# EAGLE design DriveBayLCD (EAGLE 6.5.0)
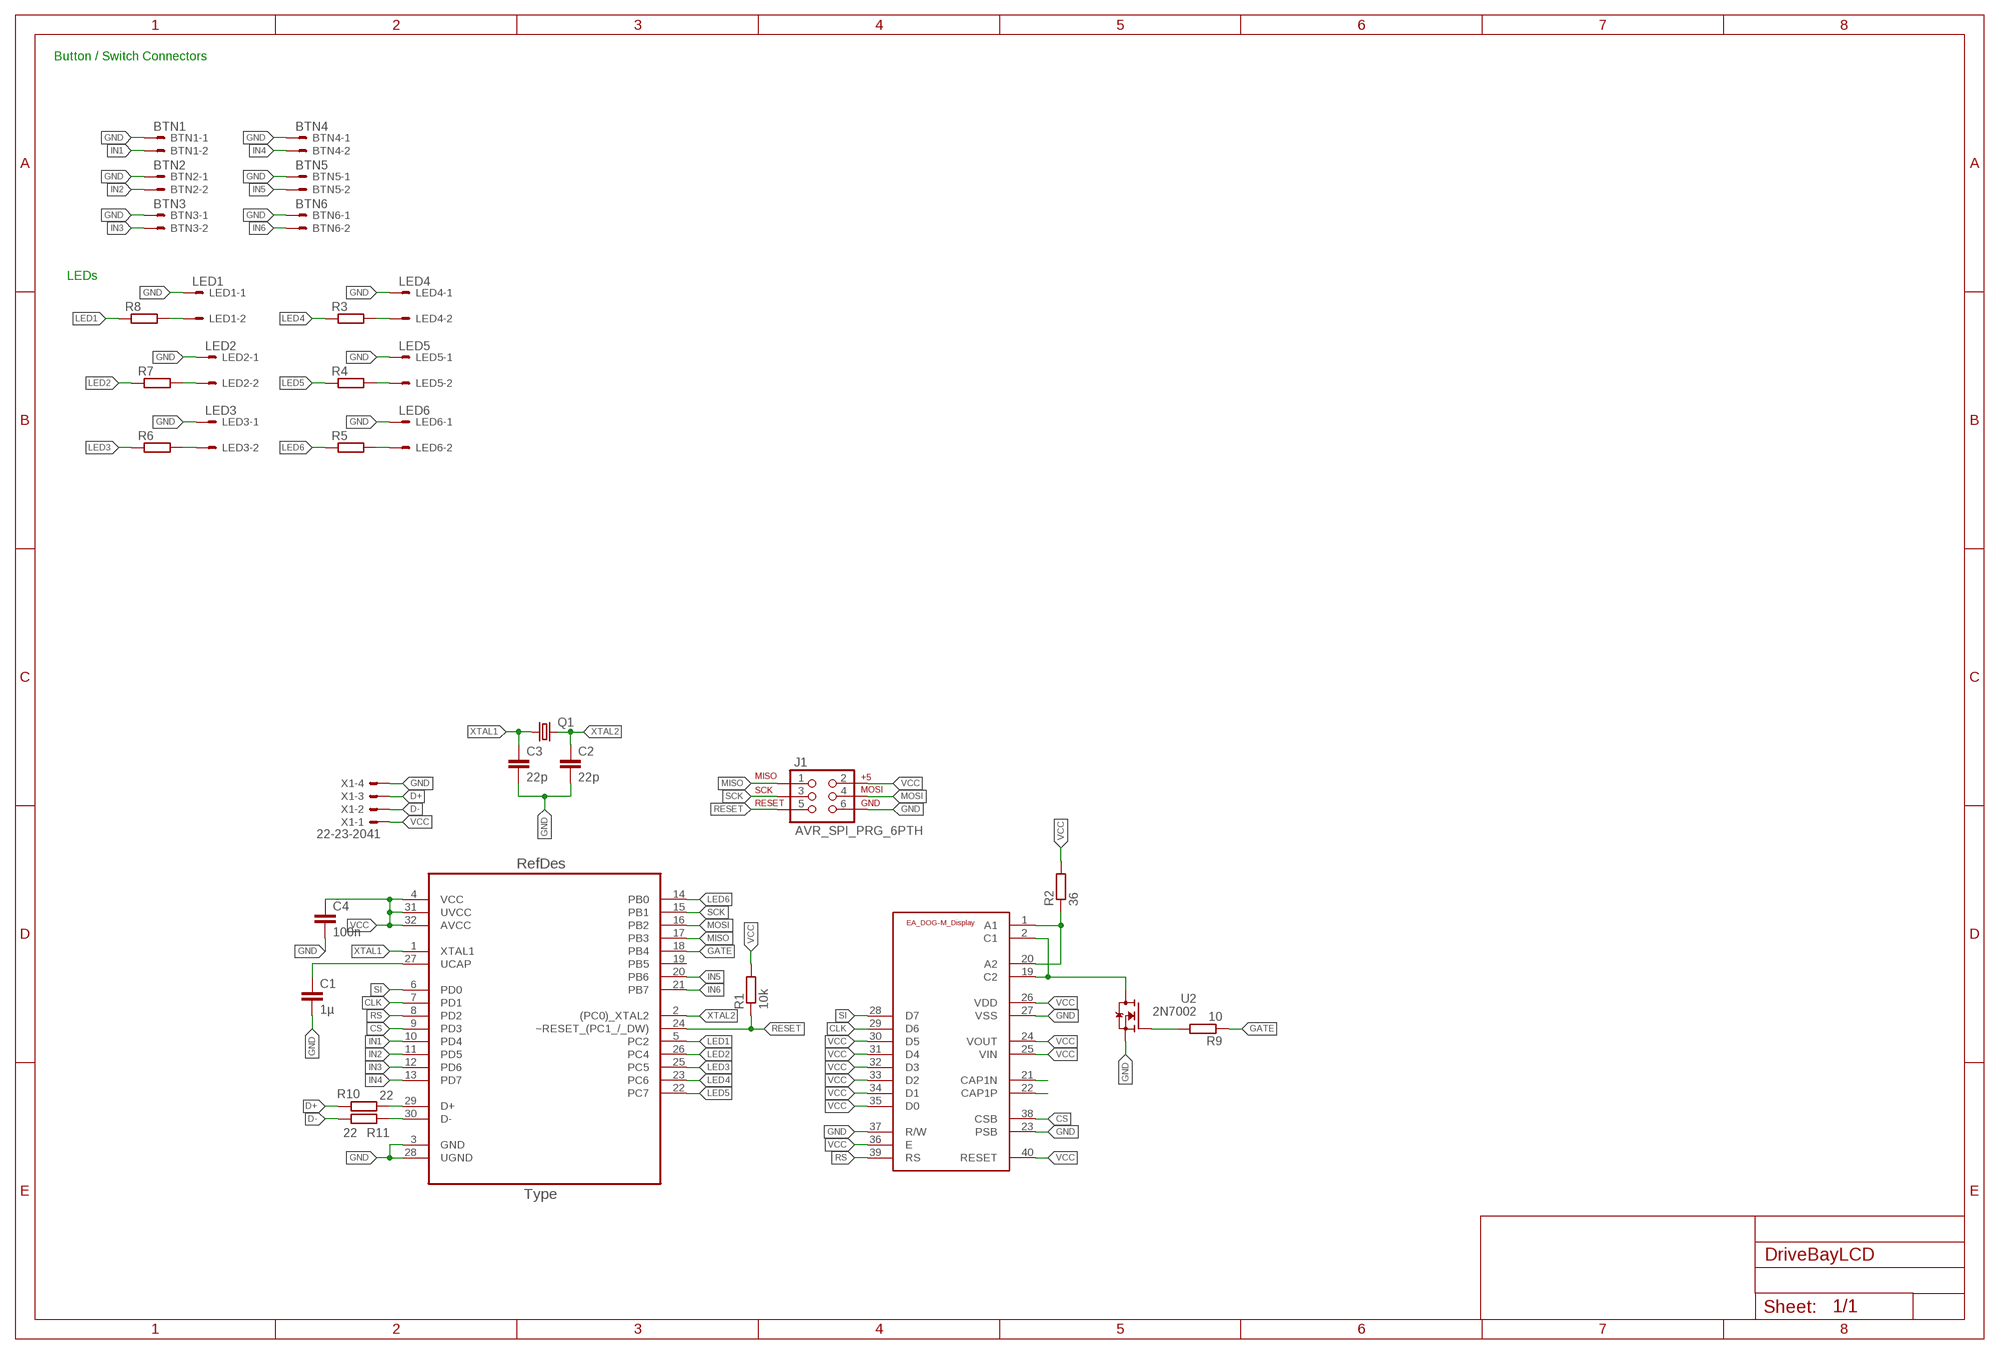
[diagram p0: schematic, sheet 1]

## Parts
BTN1  BTN1  22-23-2021  [22-23-2021]
BTN2  BTN2  22-23-2021  [22-23-2021]
BTN3  BTN3  22-23-2021  [22-23-2021]
BTN4  BTN4  22-23-2021  [22-23-2021]
BTN5  BTN5  22-23-2021  [22-23-2021]
BTN6  BTN6  22-23-2021  [22-23-2021]
C1  1µ  C-EUC0805  [C0805]
C2  22p  C-EUC0805  [C0805]
C3  22p  C-EUC0805  [C0805]
C4  100n  C-EUC0805  [C0805]
J1  AVR_SPI_PRG_6PTH  [2X3]
LED1  LED1  22-23-2021  [22-23-2021]
LED2  LED2  22-23-2021  [22-23-2021]
LED3  LED3  22-23-2021  [22-23-2021]
LED4  LED4  22-23-2021  [22-23-2021]
LED5  LED5  22-23-2021  [22-23-2021]
LED6  LED6  22-23-2021  [22-23-2021]
Q1  CRYSTALHC49S  [HC49/S]
R1  10k  R-EU_R0805  [R0805]
R2  36  R-EU_R0805  [R0805]
R3  R-EU_R0805  [R0805]
R4  R-EU_R0805  [R0805]
R5  R-EU_R0805  [R0805]
R6  R-EU_R0805  [R0805]
R7  R-EU_R0805  [R0805]
R8  R-EU_R0805  [R0805]
R9  10  R-EU_R0805  [R0805]
R10  22  R-EU_R0805  [R0805]
R11  22  R-EU_R0805  [R0805]
U1  ATMEGA32U2-AU  [QFP80P900X900X120-32N]
U2  2N7002  [SOT23-3-ROTATED]
U$1  EA_DOG-M_DISPLAY  [E_DOG-M_DISPLAY]
X1  22-23-2041  [22-23-2041]

## Nets
CLK: U1.7(PD1) U$1.29(D6)
CS: U1.9(PD3) U$1.38(CSB)
D+: R10.2 X1.3
D-: R11.2 X1.2
GATE: R9.1 U1.18(PB4)
GND: BTN1.1 BTN2.1 BTN3.1 BTN4.1 BTN5.1 BTN6.1 C1.2 C2.2 C3.2 C4.2 J1.6 LED1.1 LED2.1 LED3.1 LED4.1 LED5.1 LED6.1 U1.3(GND) U1.28(UGND) U2.2(S) U$1.23(PSB) U$1.27(VSS) U$1.37(R/W) X1.4
IN1: BTN1.2 U1.10(PD4)
IN2: BTN2.2 U1.11(PD5)
IN3: BTN3.2 U1.12(PD6)
IN4: BTN4.2 U1.13(PD7)
IN5: BTN5.2 U1.20(PB6)
IN6: BTN6.2 U1.21(PB7)
LED1: R8.1 U1.5(PC2)
LED2: R7.1 U1.26(PC4)
LED3: R6.1 U1.25(PC5)
LED4: R3.1 U1.23(PC6)
LED5: R4.1 U1.22(PC7)
LED6: R5.1 U1.14(PB0)
MISO: J1.1 U1.17(PB3)
MOSI: J1.4 U1.16(PB2)
N$1: LED1.2 R8.2
N$2: LED2.2 R7.2
N$4: LED3.2 R6.2
N$5: LED6.2 R5.2
N$6: C1.1 U1.27(UCAP)
N$7: LED5.2 R4.2
N$8: LED4.2 R3.2
N$25: R2.1 U$1.1(A1) U$1.20(A2)
N$33: U$1.21(CAP1N)
N$34: U$1.22(CAP1P)
N$123: R9.2 U2.1(G)
N$125: R10.1 U1.29(D+)
N$126: R11.1 U1.30(D-)
RESET: J1.5 R1.1 U1.24(~RESET_(PC1_/_DW))
RS: U1.8(PD2) U$1.39(RS)
SCK: J1.3 U1.15(PB1)
SI: U1.6(PD0) U$1.28(D7)
V$1: U2.3(D) U$1.2(C1) U$1.19(C2)
VCC: C4.1 J1.2 R1.2 R2.2 U1.4(VCC) U1.31(UVCC) U1.32(AVCC) U$1.24(VOUT) U$1.25(VIN) U$1.26(VDD) U$1.30(D5) U$1.31(D4) U$1.32(D3) U$1.33(D2) U$1.34(D1) U$1.35(D0) U$1.36(E) U$1.40(RESET) X1.1
XTAL1: C3.1 Q1.1 U1.1(XTAL1)
XTAL2: C2.1 Q1.2 U1.2((PC0)_XTAL2)
Unconnected: U1.19(PB5)

## Notes on the sheet
- Button / Switch Connectors
- LEDs

## Library data of the parts
BTN1-BTN6 LED1-LED6 = con-molex:22-23-2021: .100" (2.54mm) Center Header - 2 Pin; MF: MOLEX; MPN: 22-23-2021; OC_FARNELL: 1462926; OC_NEWARK: 25C3832
C1-C4 = rcl:C-EU: CAPACITOR, European symbol
J1 = SparkFun:AVR_SPI_PRG_6: AVR ISP 6 Pin This is the reduced ISP connector for AVR programming. Common on Arduino. This footprint will take up less PCB space and can be used with a 10-pin to 6-pin adapter such as SKU: BOB-08508
Q1 = crystal:CRYSTAL: CRYSTAL; OC_FARNELL: 1667008; OC_NEWARK: unknown
R1-R11 = resistor:R-EU_: RESISTOR, European symbol
U1 = Atmel-ATMEGA32U2-AU:ATMEGA32U2-AU; DESCRIPTION: 8-bit Microcontroller with ISP Flash and USB Controller; MPN: ATMEGA32U2-AU; OC_FARNELL: 1748524; OC_NEWARK: 26R5632; PACKAGE: TQFP-32; SUPPLIER: Atmel
U2 = SteveMarple:2N7002: N-CHANNEL ENHANCEMENT MODE FIELD EFFECT TRANSISTOR; MPN: 2N7002-7-F; OC_FARNELL: 1713823; OC_NEWARK: 25R5679; PACKAGE: SOT-23-3; SUPPLIER: DIODES INC.
U$1 = display_ea_dog-m:EA_DOG-M_DISPLAY
X1 = con-molex:22-23-2041: .100" (2.54mm) Center Header - 4 Pin; MF: MOLEX; MPN: 22-23-2041; OC_FARNELL: 1462920; OC_NEWARK: 38C0355

## Board
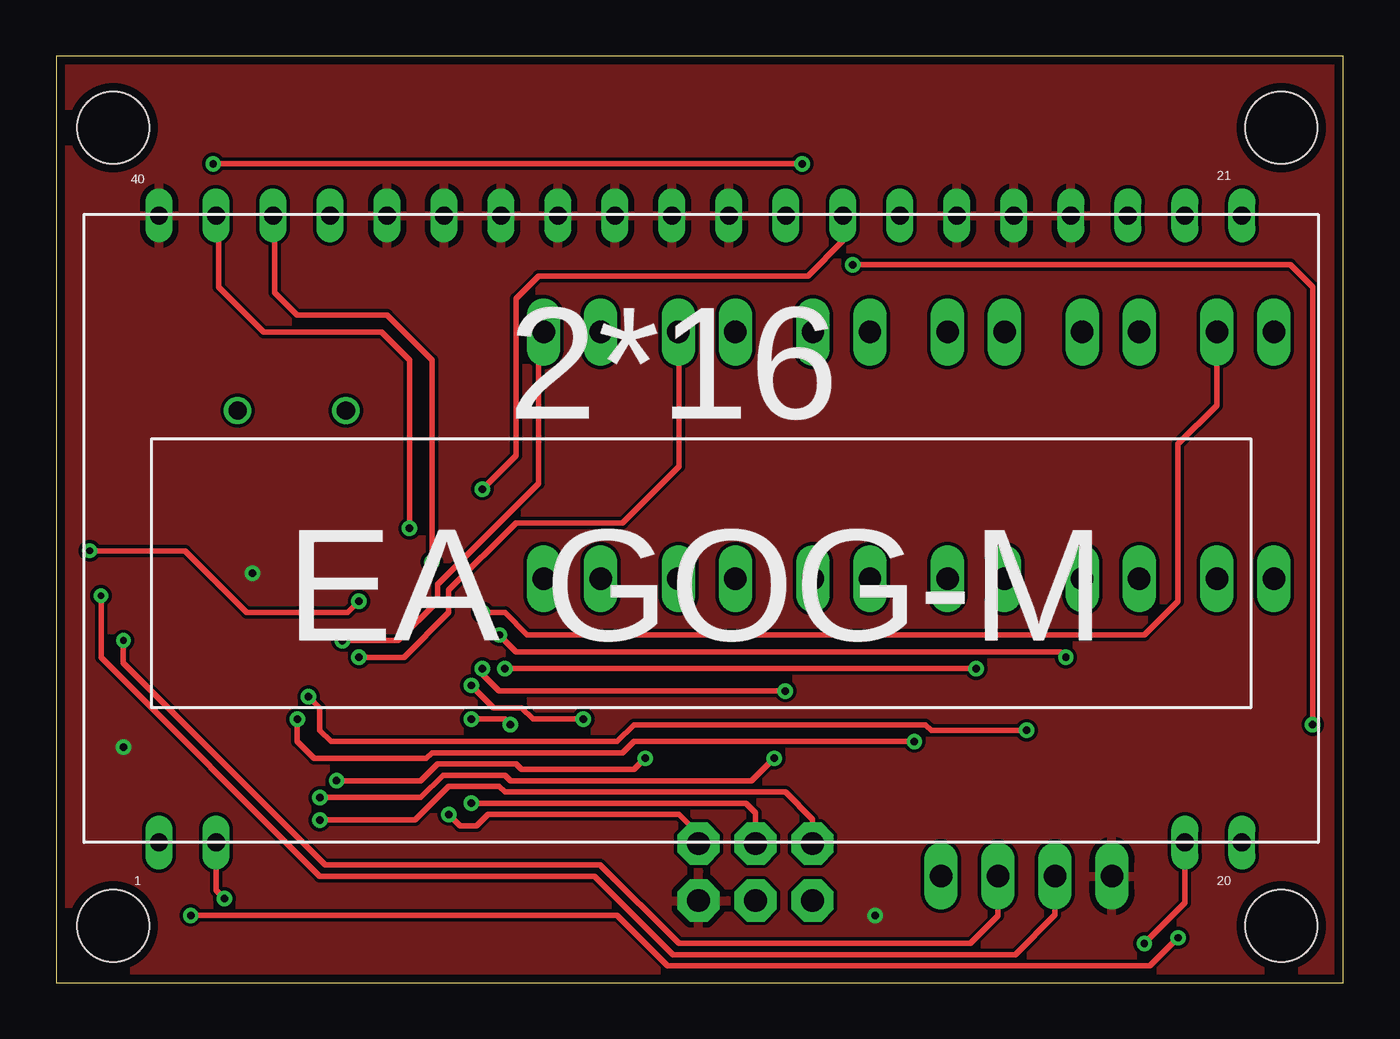
[diagram p1: board, top side]
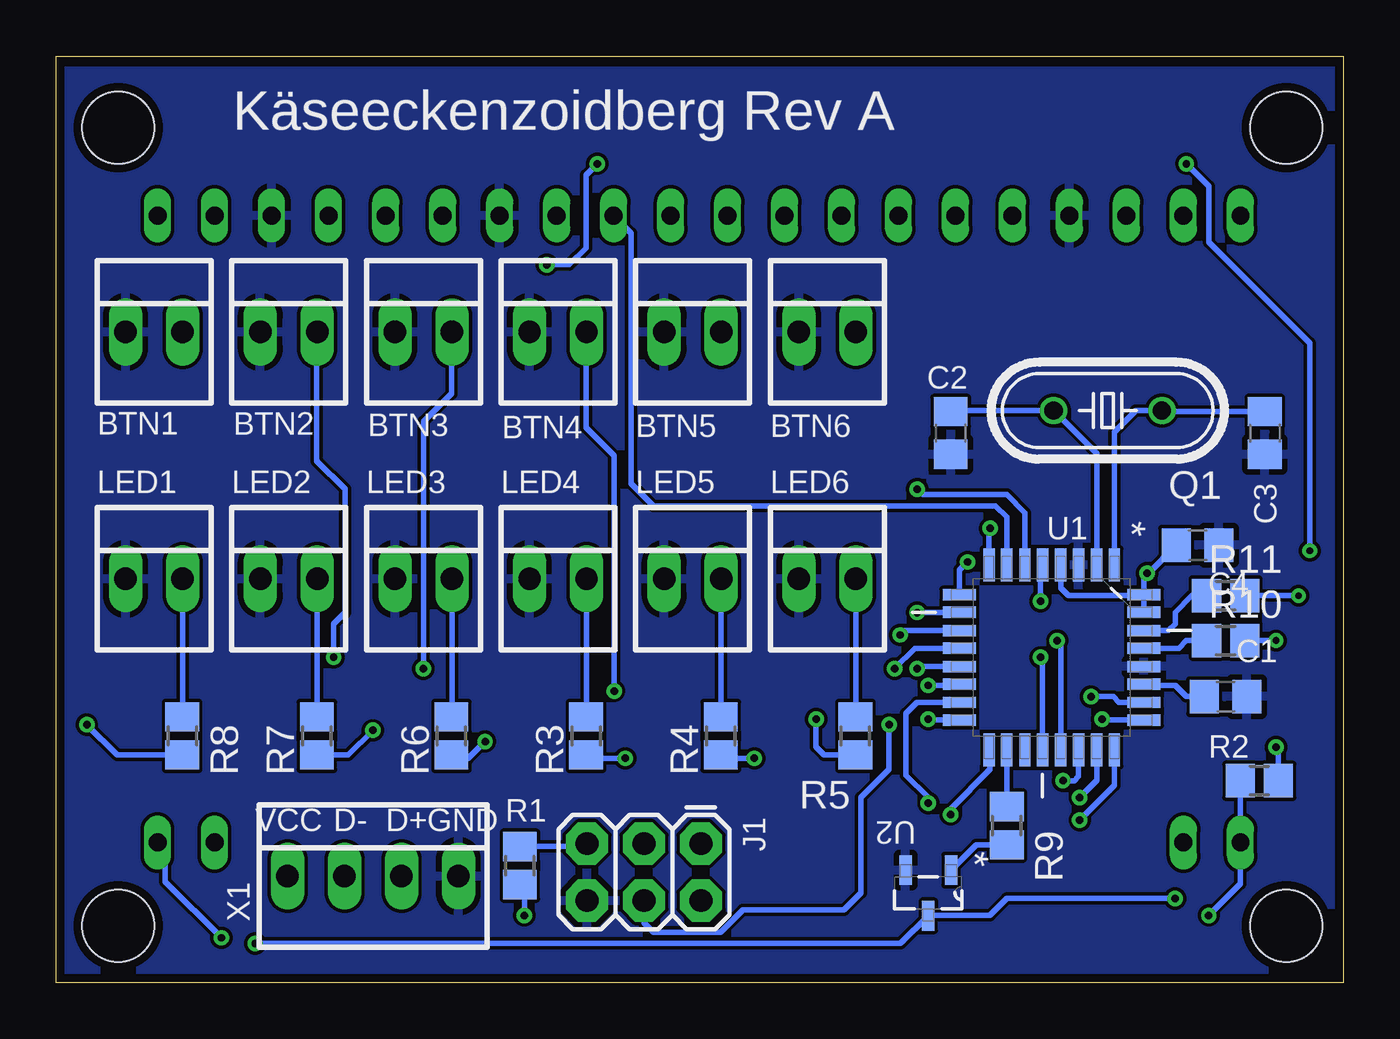
[diagram p2: board, bottom side, seen from below]

Size 57.37 x 41.3 mm. Coordinates in mm from the lower left corner, seen from the top.
Outline: 0,0 57.37,0 57.37,41.3 0,41.3 0,0
Copper layers (1*16): Top 0.0356mm / dielectric 1.5011mm / Bottom 0.0356mm
Design rules "LaenPCBOrder": minimum track width 6mil, minimum drill 13mil, track to track 6mil, track to pad 6mil, pad to pad 6mil, via to via 6mil, smd to smd 6mil, copper to edge 15mil, drill to drill 6mil, minimum pad ring 7mil, minimum via ring 7mil, stop-mask expansion 3mil, vias tented up to drill 0mil, thermal gap 10mil
Holes 3.2 mm at 2.54,2.54 54.61,2.54 54.61,38.1 2.54,38.1

### Footprints (pad centres in the part's own frame; a part is rotated, then mirrored left to right if it is on the bottom)
22-23-2021 = drill 1 long: 1 -1.27,0; 2 1.27,0
C0805 = smd 1.3 x 1.5: 1 -0.95,0; 2 0.95,0
2X3 = drill 1.016 pad 1.88 octagon: 1 0,0; 2 0,2.54; 3 2.54,0; 4 2.54,2.54; 5 5.08,0; 6 5.08,2.54
HC49/S = drill 0.813: 1 -2.413,0; 2 2.413,0
R0805 = smd 1.3 x 1.5: 1 -0.85,0; 2 0.85,0
QFP80P900X900X120-32N = smd 1.473 x 0.508: 1 -4.115,2.794; 2 -4.115,2.007; 3 -4.115,1.194; 4 -4.115,0.406; 5 -4.115,-0.406; 6 -4.115,-1.194; 7 -4.115,-2.007; 8 -4.115,-2.794; 17 4.115,-2.794; 18 4.115,-2.007; 19 4.115,-1.194; 20 4.115,-0.406; 21 4.115,0.406; 22 4.115,1.194; 23 4.115,2.007; 24 4.115,2.794 | smd 0.508 x 1.473: 9 -2.794,-4.115; 10 -2.007,-4.115; 11 -1.194,-4.115; 12 -0.406,-4.115; 13 0.406,-4.115; 14 1.194,-4.115; 15 2.007,-4.115; 16 2.794,-4.115; 25 2.794,4.115; 26 2.007,4.115; 27 1.194,4.115; 28 0.406,4.115; 29 -0.406,4.115; 30 -1.194,4.115; 31 -2.007,4.115; 32 -2.794,4.115
SOT23-3-ROTATED = smd 1.321 x 0.559: 1 -1.016,1.016; 2 -1.016,-1.016; 3 1.016,0
E_DOG-M_DISPLAY = drill 0.8 long: 1 3.334,0; 2 5.874,0; 19 49.054,0; 20 51.594,0; 21 51.594,27.94; 22 49.054,27.94; 23 46.514,27.94; 24 43.974,27.94; 25 41.434,27.94; 26 38.894,27.94; 27 36.354,27.94; 28 33.814,27.94; 29 31.274,27.94; 30 28.734,27.94; 31 26.194,27.94; 32 23.654,27.94; 33 21.114,27.94; 34 18.574,27.94; 35 16.034,27.94; 36 13.494,27.94; 37 10.954,27.94; 38 8.414,27.94; 39 5.874,27.94; 40 3.334,27.94
22-23-2041 = drill 1 long: 1 -3.81,0; 2 -1.27,0; 3 1.27,0; 4 3.81,0

### Placement (x,y rotation side)
BTN1  53,29 0 bottom
BTN2  47,29 0 bottom
BTN3  41,29 0 bottom
BTN4  35,29 0 bottom
BTN5  29,29 0 bottom
BTN6  23,29 0 bottom
C1  5.25,12.75 0 bottom
C2  17.5,24.5 270 bottom
C3  3.5,24.5 270 bottom
C4  6.5,19.5 0 bottom
J1  28.63,6.2 180 bottom
LED1  53,18 0 bottom
LED2  47,18 0 bottom
LED3  41,18 0 bottom
LED4  35,18 0 bottom
LED5  29,18 0 bottom
LED6  23,18 0 bottom
Q1  10.5,25.5 180 bottom
R1  36.7,5.22 270 bottom
R2  3.75,9 0 bottom
R3  33.75,11 90 bottom
R4  27.75,11 90 bottom
R5  21.75,11 90 bottom
R6  39.75,11 90 bottom
R7  45.75,11 90 bottom
R8  51.75,11 90 bottom
R9  15,7 270 bottom
R10  5.25,15.25 0 bottom
R11  5.25,17.25 0 bottom
U1  13,14.5 270 bottom
U2  18.5,4 270 bottom
U$1  1.25,6.25 0 top
X1  43.25,4.75 0 bottom

### Tracks (layer width: path | path; a pad name or v marks a point on that pad's centre or on a via)
CLK
  Bottom 0.254: U1.7 15.01,20.76 15.5,21.25 30.75,21.25 31.75,22.25 31.75,33.42 U$1.29
CS  (via drill 0.33)
  Top 0.254: v16.75,18.75 16.75,27.75 14.75,29.75 10.75,29.75 9.75,30.75 9.75,34.1 U$1.38
  Bottom 0.254: U1.9 17.11,18.39 v16.75,18.75
D+  (via drill 0.3)
  Top 0.254: X1.3 41.98,2.98 40.75,1.75 27.75,1.75 24.25,5.25 12,5.25 3,14.25 v3,15.25
  Bottom 0.254: R10.2 v3,15.25
D-  (via drill 0.3)
  Top 0.254: v2,17.25 2,14.5 11.75,4.75 24,4.75 27.5,1.25 42.75,1.25 44.52,3.02 X1.2
  Bottom 0.254: R11.2 v2,17.25
GATE
  Bottom 0.254: R9.1 15,10.38 U1.18
GND
  pour Bottom: 0,0 57.15,0 57.15,40.64 0,40.64
IN1  (via drill 0.33)
  Top 0.254: BTN1.2 51.73,25.73 50,24 50,17 48.5,15.5 21,15.5 20,16.5 v19,16.5
  Bottom 0.254: U1.10 v18.99,16.51 v19,16.5
IN2  (via drill 0.33)
  Top 0.254: v19.75,15.5 20.5,14.75 44.75,14.75 v45,14.5
  Bottom 0.254: U1.11 19.56,15.69 v19.75,15.5 | v45,14.5 45,16 44.5,16.5 44.5,22 45.75,23.25 45.75,28.98 BTN2.2
IN3  (via drill 0.33)
  Top 0.254: v20,14 v41,14
  Bottom 0.254: U1.12 19.09,14.91 v20,14 | v41,14 41,25 39.75,26.25 39.75,28.98 BTN3.2
IN4  (via drill 0.33)
  Top 0.254: v19,14 19,13.75 19.75,13 v32.5,13
  Bottom 0.254: U1.13 18.91,14.09 v19,14 | v32.5,13 32.5,23.5 33.75,24.75 33.75,28.98 BTN4.2
IN5  (via drill 0.33)
  Top 0.254: v13.5,14.5 15.5,14.5 17.5,16.5 17.5,17.5 20.5,20.5 25.25,20.5 27.75,23 27.75,28.98 BTN5.2
  Bottom 0.254: U1.20 13.41,14.41 v13.5,14.5
IN6  (via drill 0.33)
  Top 0.254: v12.75,15.25 15.25,15.25 17,17 17,17.75 21.5,22.25 21.5,28.77 BTN6.2
  Bottom 0.254: U1.21 12.59,15.09 v12.75,15.25
LED1  (via drill 0.3, 0.33)
  Top 0.254: v56,11.5 56,31 55,32 v35.5,32 | v13.5,17 13,16.5 8.5,16.5 5.75,19.25 v1.5,19.25 | v33.25,36.5 v7,36.5
  Bottom 0.254: R8.1 54.65,10.15 v56,11.5 | v1.5,19.25 1.5,28.5 6,33 6,35.5 v7,36.5 | v13.5,17 13.5,18.52 U1.5 | v35.5,32 34.5,32 33.75,32.75 33.75,36 v33.25,36.5
LED2  (via drill 0.33)
  Top 0.254: v43.25,11.25 39,11.25 38.75,11.5 25.75,11.5 25,10.75 12.25,10.75 11.75,11.25 11.75,12.25 v11.25,12.75
  Bottom 0.254: R7.1 44.35,10.15 v43.25,11.25 | v11.25,12.75 10.25,12.75 10,12.5 U1.26
LED3  (via drill 0.33)
  Top 0.254: v10.75,11.75 10.75,10.75 11.5,10 16.5,10 16.75,10.25 25.25,10.25 25.75,10.75 v38.25,10.75
  Bottom 0.254: U1.25 10.71,11.71 v10.75,11.75 | v38.25,10.75 39,10 39.6,10 R6.1
LED4  (via drill 0.33)
  Top 0.254: v11.75,8.25 16.25,8.25 17.25,9.25 20,9.25 20.25,9 31,9 v32,10
  Bottom 0.254: U1.23 10.99,9.01 v11.75,8.25 | v32,10 33.6,10 R3.1
LED5  (via drill 0.33)
  Top 0.254: v12.5,9 16.25,9 17,9.75 20.5,9.75 20.75,9.5 25.75,9.5 v26.25,10
  Bottom 0.254: U1.22 11.81,9.19 12,9 v12.5,9 | v26.25,10 27.6,10 R4.1
LED6  (via drill 0.33)
  Top 0.254: v23.5,11.75 21.25,11.75 20.75,12.25 19.5,12.25 v18.5,13.25
  Bottom 0.254: R5.1 23.15,10.15 23.5,10.5 v23.5,11.75 | v18.5,13.25 17.17,13.25 U1.14
MISO  (via drill 0.33)
  Top 0.254: J1.1 28.63,6.62 27.75,7.5 19.25,7.5 18.75,7 18,7 v17.5,7.5
  Bottom 0.254: v17.5,7.5 17.5,7.75 15.75,9.5 15.75,10.34 U1.17
MOSI  (via drill 0.33)
  Top 0.254: v18.5,11.75 20,11.75 v20.25,11.5
  Bottom 0.254: J1.4 31.17,2.67 30.75,2.25 27.75,2.25 26.75,3.25 22.25,3.25 21.5,4 21.5,8.25 20.25,9.5 v20.25,11.5 | U1.16 18.46,11.71 v18.5,11.75
N$1
  Bottom 0.254: R8.2 51.73,11.85 LED1.2
N$2
  Bottom 0.254: R7.2 45.73,11.85 LED2.2
N$4
  Bottom 0.254: R6.2 39.73,11.85 LED3.2
N$5
  Bottom 0.254: R5.2 21.73,11.85 LED6.2
N$6
  Bottom 0.254: U1.27 8.83,13.25 7.5,13.25 7,12.75 C1.1
N$7
  Bottom 0.254: R4.2 27.73,11.85 LED5.2
N$8
  Bottom 0.254: R3.2 33.73,11.85 LED4.2
N$25  (via drill 0.33)
  Top 0.254: v6,3 25,3 27.25,0.75 48.75,0.75 v50,2
  Bottom 0.254: R2.1 4.58,8.98 U$1.1 4.58,4.42 v6,3 | v50,2 52.5,4.5 52.5,5.91 U$1.20
N$123
  Bottom 0.254: R9.2 16.35,6.15 U2.1
N$125
  Bottom 0.254: U1.29 7.34,14.91 7,15.25 R10.1
N$126
  Bottom 0.254: U1.30 7.81,15.69 7.5,16 7.5,16.5 6.75,17.25 R11.1
RESET  (via drill 0.33)
  Top 0.254: J1.5 33.71,7.29 32.5,8.5 20,8.5 19.75,8.75 17.5,8.75 16,7.25 v11.75,7.25
  Bottom 0.254: R1.1 33.84,6.07 J1.5 | U1.24 10.21,8.79 v11.75,7.25
RS  (via drill 0.33)
  Top 0.254: v15.75,20.25 15.75,27.75 14.5,29 9.25,29 7.25,31 7.25,34.06 U$1.39
  Bottom 0.254: U1.8 15.79,20.21 v15.75,20.25
SCK  (via drill 0.33)
  Top 0.254: J1.3 31.17,7.58 30.75,8 v18.5,8
  Bottom 0.254: v18.5,8 18.5,8.25 19.5,9.25 19.5,12 19,12.5 U1.15
SI  (via drill 0.33)
  Top 0.254: U$1.28 35.06,33.06 33.5,31.5 21.5,31.5 20.5,30.5 20.5,23.5 v19,22
  Bottom 0.254: v19,22 18.75,21.75 15,21.75 14.19,20.94 U1.6
V$1  (via drill 0.33)
  Top 0.254: U$1.19 50.3,3.55 v48.5,1.75 | U$1.2 7.12,4.13 v7.5,3.75
  Bottom 0.254: v48.5,1.75 19.73,1.75 U2.3 18.48,3 15.75,3 15,3.75 v7.5,3.75
VCC  (via drill 0.33)
  Bottom 0.254: U1.32 U1.31 | U1.4 12.59,17.59 12.25,17.25 8.93,17.25 U1.32 | U1.32 8.88,18.11 v8.75,18.25 8.7,18.25 C4.1 | R2.2 2.9,10.4 v3,10.5 | v36.5,3 36.5,4.17 R1.2
  pour Top: 0,0 57.5,0 57.5,41.5 0,41.5
XTAL1
  Bottom 0.254: U1.1 10.21,24.54 9.25,25.5 Q1.1 8.04,25.45 C3.1
XTAL2
  Bottom 0.254: U1.2 10.99,23.58 Q1.2 17.45,25.5 C2.1

### Text on the board
bPlace: Käseeckenzoidberg Rev A | GND | D+ | D- | VCC